# EAGLE design ultra96_mipi (EAGLE 9.7.0)
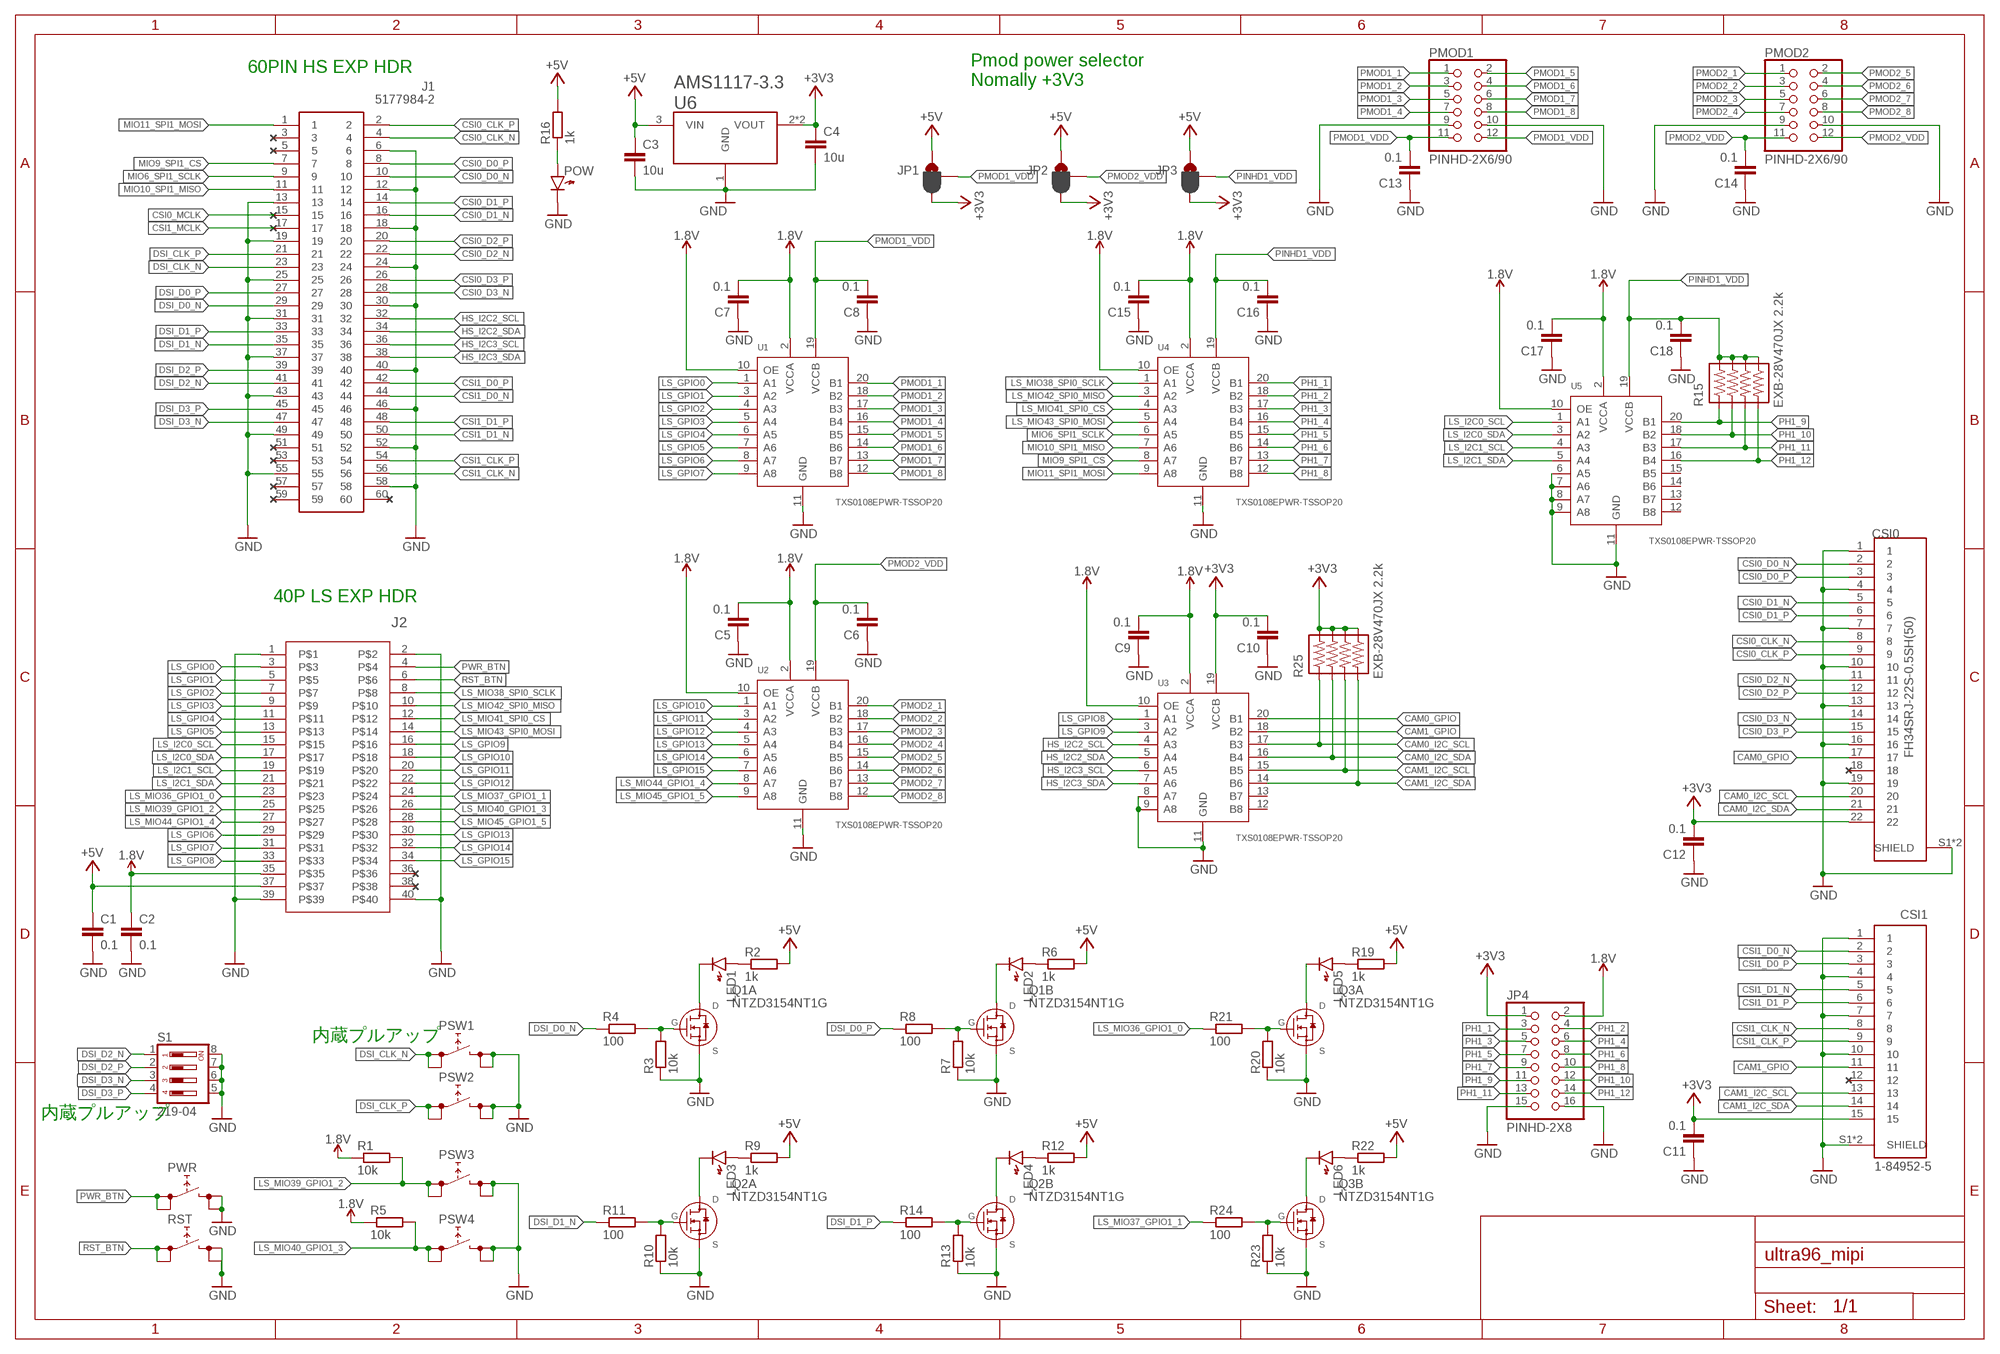
[diagram p0: schematic, sheet 1]

## Parts
C1  0.1  C-EUC0603  [C0603]
C2  0.1  C-EUC0603  [C0603]
C3  10u  C-EUC0603  [C0603]
C4  10u  C-EUC0603  [C0603]
C5  0.1  C-EUC0603  [C0603]
C6  0.1  C-EUC0603  [C0603]
C7  0.1  C-EUC0603  [C0603]
C8  0.1  C-EUC0603  [C0603]
C9  0.1  C-EUC0603  [C0603]
C10  0.1  C-EUC0603  [C0603]
C11  0.1  C-EUC0603  [C0603]
C12  0.1  C-EUC0603  [C0603]
C13  0.1  C-EUC0603  [C0603]
C14  0.1  C-EUC0603  [C0603]
C15  0.1  C-EUC0603  [C0603]
C16  0.1  C-EUC0603  [C0603]
C17  0.1  C-EUC0603  [C0603]
C18  0.1  C-EUC0603  [C0603]
CSI0  FH34SRJ-22S-0.5SH(50)  [HRS_FH34SRJ-22S-0.5SH(50)]
CSI1  1-84952-5  [TE_1-84952-5]
J1  5177984-2  [51779842]
J2  57202-G52-20LFCONN40_52-20LF_AMP  [CONN40_52-20LF_AMP]
JP1  JUMPER-SMT_3_1-NC_PASTE_SILK  [SMT-JUMPER_3_1-NC_PASTE_SILK]
JP2  JUMPER-SMT_3_1-NC_PASTE_SILK  [SMT-JUMPER_3_1-NC_PASTE_SILK]
JP3  JUMPER-SMT_3_1-NC_PASTE_SILK  [SMT-JUMPER_3_1-NC_PASTE_SILK]
JP4  PINHD-2X8  [2X08]
LED1  LED1608  [LED1608]
LED2  LED1608  [LED1608]
LED3  LED1608  [LED1608]
LED4  LED1608  [LED1608]
LED5  LED1608  [LED1608]
LED6  LED1608  [LED1608]
PMOD1  PINHD-2X6/90  [2X06/90]
PMOD2  PINHD-2X6/90  [2X06/90]
POW  LED1608  [LED1608]
PSW1  SKRPACE010  [SKRPACE010]
PSW2  SKRPACE010  [SKRPACE010]
PSW3  SKRPACE010  [SKRPACE010]
PSW4  SKRPACE010  [SKRPACE010]
PWR  SKRPACE010  [SKRPACE010]
Q1  NTZD3154NT1G  [SOTFL50P160X60-6N]
Q2  NTZD3154NT1G  [SOTFL50P160X60-6N]
Q3  NTZD3154NT1G  [SOTFL50P160X60-6N]
R1  10k  R-EU_R0603  [R0603]
R2  1k  R-EU_R0603  [R0603]
R3  10k  R-EU_R0603  [R0603]
R4  100  R-EU_R0603  [R0603]
R5  10k  R-EU_R0603  [R0603]
R6  1k  R-EU_R0603  [R0603]
R7  10k  R-EU_R0603  [R0603]
R8  100  R-EU_R0603  [R0603]
R9  1k  R-EU_R0603  [R0603]
R10  10k  R-EU_R0603  [R0603]
R11  100  R-EU_R0603  [R0603]
R12  1k  R-EU_R0603  [R0603]
R13  10k  R-EU_R0603  [R0603]
R14  100  R-EU_R0603  [R0603]
R15  EXB-28V470JX 2.2k  EXB-28V470JX  [EXB-28V470JX]
R16  1k  R-EU_R0603  [R0603]
R19  1k  R-EU_R0603  [R0603]
R20  10k  R-EU_R0603  [R0603]
R21  100  R-EU_R0603  [R0603]
R22  1k  R-EU_R0603  [R0603]
R23  10k  R-EU_R0603  [R0603]
R24  100  R-EU_R0603  [R0603]
R25  EXB-28V470JX 2.2k  EXB-28V470JX  [EXB-28V470JX]
RST  SKRPACE010  [SKRPACE010]
S1  219-04  [CTS-219-04]
U1  TXS0108EPWR-TSSOP20  LOGIC-TXS0108EPWR(TSSOP20)  [TSSOP20-0.65-6.5X4.4MM]
U2  TXS0108EPWR-TSSOP20  LOGIC-TXS0108EPWR(TSSOP20)  [TSSOP20-0.65-6.5X4.4MM]
U3  TXS0108EPWR-TSSOP20  LOGIC-TXS0108EPWR(TSSOP20)  [TSSOP20-0.65-6.5X4.4MM]
U4  TXS0108EPWR-TSSOP20  LOGIC-TXS0108EPWR(TSSOP20)  [TSSOP20-0.65-6.5X4.4MM]
U5  TXS0108EPWR-TSSOP20  LOGIC-TXS0108EPWR(TSSOP20)  [TSSOP20-0.65-6.5X4.4MM]
U6  AMS1117-3.3  [SOT229P700X180-4N]

## Nets
1.8V: C2.1 C5.2 C7.2 C9.2 C15.2 C17.2 J2.35 JP4.2 R1.1 R5.1 U1.2(VCCA) U1.10(OE) U2.2(VCCA) U2.10(OE) U3.2(VCCA) U3.10(OE) U4.2(VCCA) U4.10(OE) U5.2(VCCA) U5.10(OE)
+3V3: C4.1 C10.2 C11.2 C12.2 CSI0.22 CSI1.15 JP1.3 JP2.3 JP3.3 JP4.1 R25.5 R25.6 R25.7 R25.8 U3.19(VCCB) U6.2(VOUT) U6.4(VOUT)
+5V: C1.1 C3.1 J2.37 JP1.1 JP2.1 JP3.1 R2.2 R6.2 R9.2 R12.2 R16.2 R19.2 R22.2 U6.3(VIN)
CAM0_GPIO: CSI0.17 U3.20(B1)
CAM0_I2C_SCL: CSI0.20 R25.1 U3.17(B3)
CAM0_I2C_SDA: CSI0.21 R25.2 U3.16(B4)
CAM1_GPIO: CSI1.11 U3.18(B2)
CAM1_I2C_SCL: CSI1.13 R25.3 U3.15(B5)
CAM1_I2C_SDA: CSI1.14 R25.4 U3.14(B6)
CSI0_CLK_N: CSI0.8 J1.4
CSI0_CLK_P: CSI0.9 J1.2
CSI0_D0_N: CSI0.2 J1.10
CSI0_D0_P: CSI0.3 J1.8
CSI0_D1_N: CSI0.5 J1.16
CSI0_D1_P: CSI0.6 J1.14
CSI0_D2_N: CSI0.11 J1.22
CSI0_D2_P: CSI0.12 J1.20
CSI0_D3_N: CSI0.14 J1.28
CSI0_D3_P: CSI0.15 J1.26
CSI0_MCLK: J1.15
CSI1_CLK_N: CSI1.8 J1.56
CSI1_CLK_P: CSI1.9 J1.54
CSI1_D0_N: CSI1.2 J1.44
CSI1_D0_P: CSI1.3 J1.42
CSI1_D1_N: CSI1.5 J1.50
CSI1_D1_P: CSI1.6 J1.48
CSI1_MCLK: J1.17
DSI_CLK_N: J1.23 PSW1.1 PSW1.2
DSI_CLK_P: J1.21 PSW2.1 PSW2.2
DSI_D0_N: J1.29 R4.1
DSI_D0_P: J1.27 R8.1
DSI_D1_N: J1.35 R11.1
DSI_D1_P: J1.33 R14.1
DSI_D2_N: J1.41 S1.1
DSI_D2_P: J1.39 S1.2
DSI_D3_N: J1.47 S1.3
DSI_D3_P: J1.45 S1.4
GND: C1.2 C2.2 C3.2 C4.2 C5.1 C6.1 C7.1 C8.1 C9.1 C10.1 C11.1 C12.1 C13.1 C14.1 C15.1 C16.1 C17.1 C18.1 CSI0.1 CSI0.4 CSI0.7 CSI0.10 CSI0.13 CSI0.16 CSI0.19 CSI0.S1(SHIELD) CSI0.S2(SHIELD) CSI1.1 CSI1.4 CSI1.7 CSI1.10 CSI1.S1(SHIELD) CSI1.S2(SHIELD) J1.6 J1.12 J1.13 J1.18 J1.19 J1.24 J1.25 J1.30 J1.31 J1.37 J1.40 J1.43 J1.46 J1.49 J1.52 J1.55 J1.58 J2.1 J2.2 J2.39 J2.40 JP4.15 JP4.16 PMOD1.9 PMOD1.10 PMOD2.9 PMOD2.10 POW.K PSW1.3 PSW1.4 PSW2.3 PSW2.4 PSW3.3 PSW3.4 PSW4.3 PSW4.4 PWR.3 PWR.4 Q1.1(A:S1) Q1.4(B:S1) Q2.1(A:S1) Q2.4(B:S1) Q3.1(A:S1) Q3.4(B:S1) R3.1 R7.1 R10.1 R13.1 R20.1 R23.1 RST.3 RST.4 S1.5 S1.6 S1.7 S1.8 U1.11(GND) U2.11(GND) U3.8(A7) U3.9(A8) U3.11(GND) U4.11(GND) U5.6(A5) U5.7(A6) U5.8(A7) U5.9(A8) U5.11(GND) U6.1(GND)
HS_I2C2_SCL: J1.32 U3.4(A3)
HS_I2C2_SDA: J1.34 U3.5(A4)
HS_I2C3_SCL: J1.36 U3.6(A5)
HS_I2C3_SDA: J1.38 U3.7(A6)
LS_GPIO0: J2.3 U1.1(A1)
LS_GPIO1: J2.5 U1.3(A2)
LS_GPIO2: J2.7 U1.4(A3)
LS_GPIO3: J2.9 U1.5(A4)
LS_GPIO4: J2.11 U1.6(A5)
LS_GPIO5: J2.13 U1.7(A6)
LS_GPIO6: J2.29 U1.8(A7)
LS_GPIO7: J2.31 U1.9(A8)
LS_GPIO8: J2.33 U3.1(A1)
LS_GPIO9: J2.16 U3.3(A2)
LS_GPIO10: J2.18 U2.1(A1)
LS_GPIO11: J2.20 U2.3(A2)
LS_GPIO12: J2.22 U2.4(A3)
LS_GPIO13: J2.30 U2.5(A4)
LS_GPIO14: J2.32 U2.6(A5)
LS_GPIO15: J2.34 U2.7(A6)
LS_I2C0_SCL: J2.15 U5.1(A1)
LS_I2C0_SDA: J2.17 U5.3(A2)
LS_I2C1_SCL: J2.19 U5.4(A3)
LS_I2C1_SDA: J2.21 U5.5(A4)
LS_MIO36_GPIO1_0: J2.23 R21.1
LS_MIO37_GPIO1_1: J2.24 R24.1
LS_MIO38_SPI0_SCLK: J2.8 U4.1(A1)
LS_MIO39_GPIO1_2: J2.25 PSW3.1 PSW3.2 R1.2
LS_MIO40_GPIO1_3: J2.26 PSW4.1 PSW4.2 R5.2
LS_MIO41_SPI0_CS: J2.12 U4.4(A3)
LS_MIO42_SPI0_MISO: J2.10 U4.3(A2)
LS_MIO43_SPI0_MOSI: J2.14 U4.5(A4)
LS_MIO44_GPIO1_4: J2.27 U2.8(A7)
LS_MIO45_GPIO1_5: J2.28 U2.9(A8)
MIO6_SPI1_SCLK: J1.9 U4.6(A5)
MIO9_SPI1_CS: J1.7 U4.8(A7)
MIO10_SPI1_MISO: J1.11 U4.7(A6)
MIO11_SPI1_MOSI: J1.1 U4.9(A8)
N$1: LED1.A R2.1
N$2: LED1.K Q1.6(A:D1)
N$3: Q1.2(A:G1) R3.2 R4.2
N$4: LED3.A R9.1
N$5: LED2.A R6.1
N$6: LED3.K Q2.6(A:D1)
N$7: POW.A R16.1
N$8: LED2.K Q1.3(B:D1)
N$9: LED4.K Q2.3(B:D1)
N$21: Q1.5(B:G1) R7.2 R8.2
N$23: Q2.2(A:G1) R10.2 R11.2
N$24: LED5.A R19.1
N$25: LED4.A R12.1
N$27: LED5.K Q3.6(A:D1)
N$28: Q3.2(A:G1) R20.2 R21.2
N$29: LED6.A R22.1
N$30: LED6.K Q3.3(B:D1)
N$31: Q3.5(B:G1) R23.2 R24.2
N$33: Q2.5(B:G1) R13.2 R14.2
PH1_1: JP4.3 U4.20(B1)
PH1_2: JP4.4 U4.18(B2)
PH1_3: JP4.5 U4.17(B3)
PH1_4: JP4.6 U4.16(B4)
PH1_5: JP4.7 U4.15(B5)
PH1_6: JP4.8 U4.14(B6)
PH1_7: JP4.9 U4.13(B7)
PH1_8: JP4.10 U4.12(B8)
PH1_9: JP4.11 R15.1 U5.20(B1)
PH1_10: JP4.12 R15.2 U5.18(B2)
PH1_11: JP4.13 R15.3 U5.17(B3)
PH1_12: JP4.14 R15.4 U5.16(B4)
PINHD1_VDD: C16.2 C18.2 JP3.2 R15.5 R15.6 R15.7 R15.8 U4.19(VCCB) U5.19(VCCB)
PMOD1_1: PMOD1.1 U1.20(B1)
PMOD1_2: PMOD1.3 U1.18(B2)
PMOD1_3: PMOD1.5 U1.17(B3)
PMOD1_4: PMOD1.7 U1.16(B4)
PMOD1_5: PMOD1.2 U1.15(B5)
PMOD1_6: PMOD1.4 U1.14(B6)
PMOD1_7: PMOD1.6 U1.13(B7)
PMOD1_8: PMOD1.8 U1.12(B8)
PMOD1_VDD: C8.2 C13.2 JP1.2 PMOD1.11 PMOD1.12 U1.19(VCCB)
PMOD2_1: PMOD2.1 U2.20(B1)
PMOD2_2: PMOD2.3 U2.18(B2)
PMOD2_3: PMOD2.5 U2.17(B3)
PMOD2_4: PMOD2.7 U2.16(B4)
PMOD2_5: PMOD2.2 U2.15(B5)
PMOD2_6: PMOD2.4 U2.14(B6)
PMOD2_7: PMOD2.6 U2.13(B7)
PMOD2_8: PMOD2.8 U2.12(B8)
PMOD2_VDD: C6.2 C14.2 JP2.2 PMOD2.11 PMOD2.12 U2.19(VCCB)
PWR_BTN: J2.4 PWR.1 PWR.2
RST_BTN: J2.6 RST.1 RST.2
Unconnected: CSI0.18 CSI1.12 J1.3 J1.5 J1.51 J1.53 J1.57 J1.59 J1.60 J2.36 J2.38 U3.12(B8) U3.13(B7) U5.12(B8) U5.13(B7) U5.14(B6) U5.15(B5)

## Notes on the sheet
- 60PIN HS EXP HDR
- Pmod power selector
  Nomally +3V3
- 40P LS EXP HDR
- 内蔵プルアップ
- 内蔵プルアップ

## Library data of the parts
C1-C18 = rcl:C-EU: CAPACITOR, European symbol; SPICEPREFIX: C
CSI0 = FH34SRJ-22S-0.5SH:FH34SRJ-22S-0.5SH(50): Check availability <https://pricing.snapeda.com/parts/FH34SRJ-22S-0.5SH%2850%29/Hirose%20Electric%20Co%20Ltd/view-part?ref=eda>; AVAILABILITY: In Stock; DESCRIPTION: 22 Position FFC, FPC Connector Contacts, Top and Bottom 0.020 (0.50mm) Surface Mount, Right Angle; MF: Hirose Electric Co Ltd; MP: FH34SRJ-22S-0.5SH(50); PACKAGE: None; PRICE: None; PURCHASE-URL: https://pricing.snapeda.com/search/part/FH34SRJ-22S-0.5SH(50)/?ref=eda
CSI1 = 1-84952-5:1-84952-5; COMMENT: 1-84952-5; EU_ROHS_COMPLIANCE: Compliant
J1 = 5177984-2:5177984-2: 60 way 0.8mm pitch SMT header,5mm H Source: Datasheet <https://datasheet.datasheetarchive.com/originals/distributors/Datasheets_SAMA/798bc7bd498d8f2cc2b47bb00bbdf8ae.pdf>; ARROW_PART_NUMBER: 5177984-2; ARROW_PRICE-STOCK: https://www.arrow.com/en/products/5177984-2/te-connectivity?region=europe; DESCRIPTION: 60 way 0.8mm pitch SMT header,5mm H; HEIGHT: 4.9mm; MANUFACTURER_NAME: TE Connectivity; MANUFACTURER_PART_NUMBER: 5177984-2; MOUSER_PART_NUMBER: 571-5177984-2; MOUSER_PRICE-STOCK: https://www.mouser.co.uk/ProductDetail/TE-Connectivity/5177984-2?qs=iZLSzymdj4T%252BY6P87SFSbw%3D%3D
J2 = 57202-G52-20LF:57202-G52-20LF; COPYRIGHT: Copyright (C) 2023 Ultra Librarian. All rights reserved.; DIGI-KEY_PART_NUMBER_1: 609-2632-ND; MANUFACTURER_PART_NUMBER: 57202-G52-20LF; MFR_NAME: Amphenol ICC
JP1-JP3 = SparkFun-Jumpers:JUMPER-SMT_3_1-NC_PASTE: Normally closed solder jumper (1 of 2 connections) This jumper has an aperture in the stencil to allow solder paste to bridge one of the two connections. One connection is normally closed (NC), while the other is normally open (NO). Wick off the solder to open the connection. Reapply solder to reclose the connection. Apply solder to the other side instead to change the current path.
JP4 = Connector:PINHD-2X8: PIN HEADER; CATEGORY: CONNECTOR; SUB-CATEGORY: PIN-HEADER
LED1-LED6 POW = generic:LED: Generic LEDs
PMOD1 PMOD2 = Connector:PINHD-2X6: PIN HEADER; CATEGORY: CONNECTOR; SUB-CATEGORY: PIN-HEADER
PSW1-PSW4 PWR RST = Switches:SKRPACE010
Q1-Q3 = NTZD3154NT1G:NTZD3154NT1G: Dual N-channel MOSFET Transistor, 0.57 A, 20 V, 6-pin SOT-563 Source: Datasheet <http://www.onsemi.com/pub/Collateral/NTZD3154N-D.PDF>; ARROW_PART_NUMBER: NTZD3154NT1G; ARROW_PRICE-STOCK: https://www.arrow.com/en/products/ntzd3154nt1g/on-semiconductor?region=nac; DESCRIPTION: Dual N-channel MOSFET Transistor, 0.57 A, 20 V, 6-pin SOT-563; HEIGHT: 0.6mm; MANUFACTURER_NAME: onsemi; MANUFACTURER_PART_NUMBER: NTZD3154NT1G; MOUSER_PART_NUMBER: 863-NTZD3154NT1G; MOUSER_PRICE-STOCK: https://www.mouser.co.uk/ProductDetail/onsemi/NTZD3154NT1G?qs=ZXBb0xZ9WeCaNvsHF5F8%252BA%3D%3D
R1-R14 R16 R19-R24 = rcl:R-EU_: RESISTOR, European symbol; SPICEPREFIX: R
R15 R25 = Resistor Array:EXB-28V470JX: RES ARRAY 4 RES 47 OHM 0804 Manufacturer's datasheet <https://industrial.panasonic.com/cdbs/www-data/pdf/AOC0000/AOC0000C14.pdf>; CREATED_BY: PCBLayout.com; DIGIKEY_PARTNO: Y7470TR-ND; MANUFACTURER: Panasonic Electronic Components; MPN: EXB-28V470JX; PACKAGE: 0804
S1 = switch-dil:219-04*: Surface Mount DIP Switch Series 219 SMT CTS Electronic Components Sourc: www.ctscorp.com; OC_FARNELL: unknown; OC_NEWARK: unknown
U1-U5 = OPL_IC:LOGIC-TXS0108EPWR(TSSOP20): 310050026; MPN: TXS0108EPWR
U6 = AMS1117-3.3:AMS1117-3.3: Check availability <https://pricing.snapeda.com/parts/AMS1117-3.3/Advanced%20Monolithic%20Systems/view-part?ref=eda>; AVAILABILITY: In Stock; DESCRIPTION: Sot223/Pkg 1-Amp 3.3-Volt Low Drop Out Voltage Regulatator; MF: Advanced Monolithic Systems; MP: AMS1117-3.3; PACKAGE: SOT-223 Seeed Technology; PRICE: None

## Board
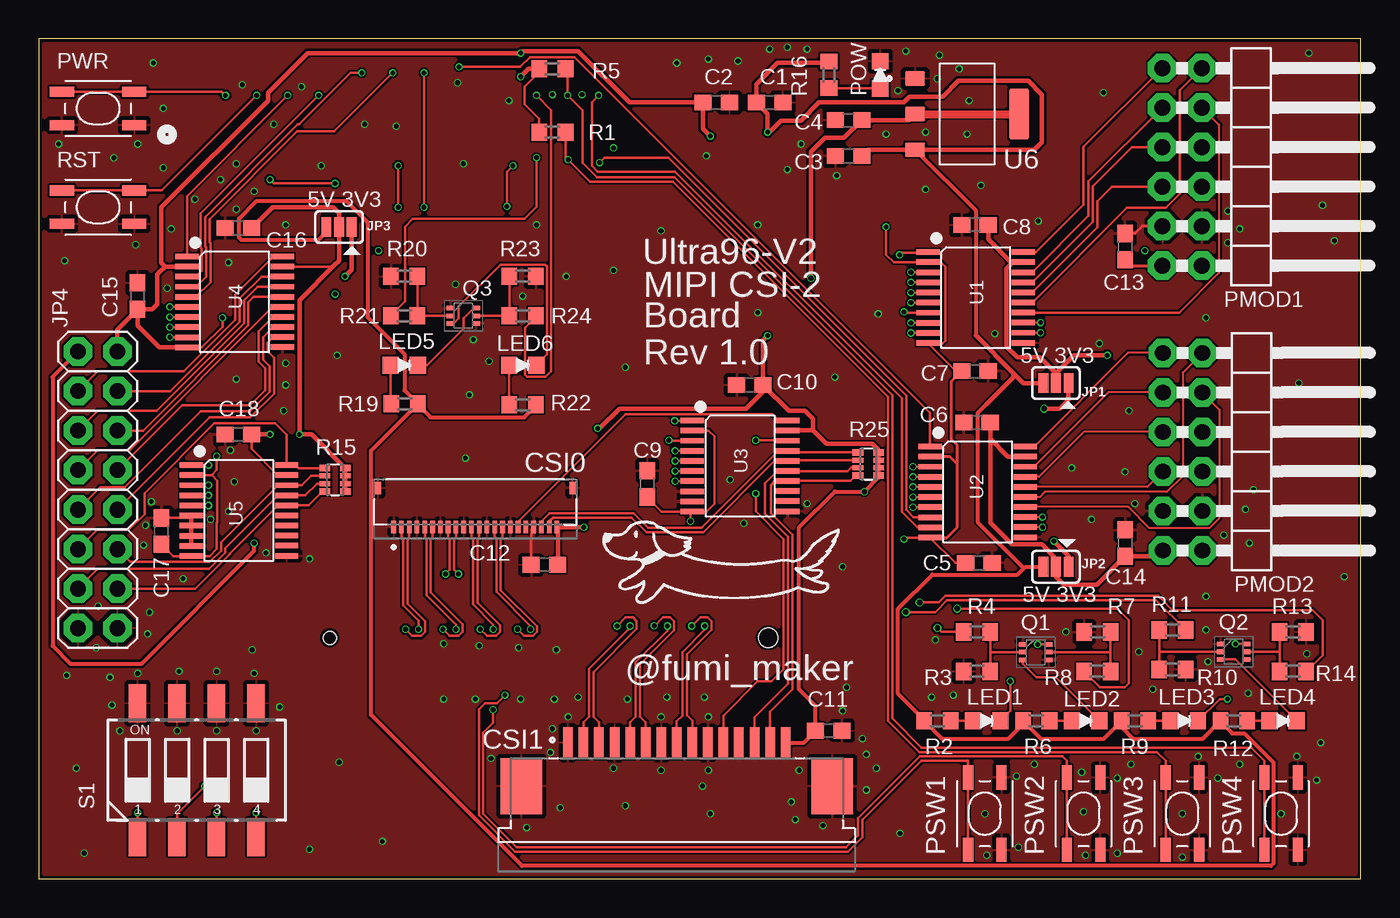
[diagram p1: board, top side]
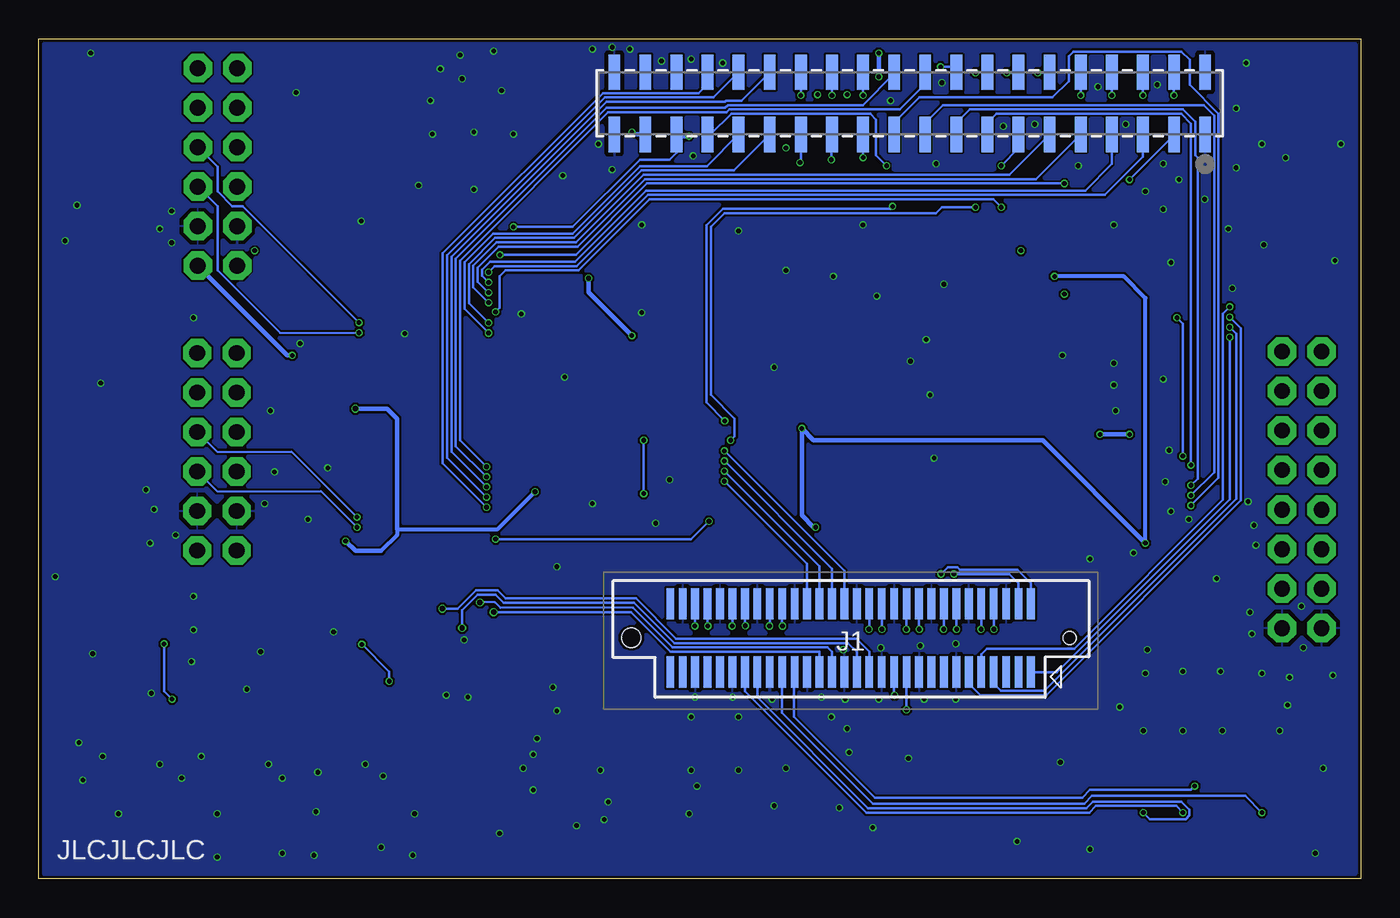
[diagram p2: board, bottom side, seen from below]

Size 85 x 54 mm. Coordinates in mm from the lower left corner, seen from the top.
Outline: 0,54 0,0 85,0 85,54 0,54
Copper layers (1*16): Top / Bottom
Stack-up Default Layer Stack: Top User Defined 0.035mm / Dielectric-1 User Defined 1.6mm / Bottom User Defined 0.035mm
Design rules "jlcpcb-2layers": minimum track width 5mil, minimum drill 0.3mm, track to track 5mil, track to pad 5mil, pad to pad 5mil, via to via 5mil, smd to smd 5mil, copper to edge 0.2mm, drill to drill 6mil, minimum pad ring 10mil, minimum via ring 3mil, stop-mask expansion 4mil, vias tented up to drill 0mil, thermal gap 10mil

### Footprints (pad centres in the part's own frame; a part is rotated, then mirrored left to right if it is on the bottom)
C0603 = smd 1.1 x 1: 1 -0.85,0; 2 0.85,0
HRS_FH34SRJ-22S-0.5SH(50) = smd 0.3 x 0.8: 1 5.25,1.25; 2 4.75,1.25; 3 4.25,1.25; 4 3.75,1.25; 5 3.25,1.25; 6 2.75,1.25; 7 2.25,1.25; 8 1.75,1.25; 9 1.25,1.25; 10 0.75,1.25; 11 0.25,1.25; 12 -0.25,1.25; 13 -0.75,1.25; 14 -1.25,1.25; 15 -1.75,1.25; 16 -2.25,1.25; 17 -2.75,1.25; 18 -3.25,1.25; 19 -3.75,1.25; 20 -4.25,1.25; 21 -4.75,1.25; 22 -5.25,1.25 | smd 0.4 x 0.8: S1 6.25,-1.25; S2 -6.25,-1.25
TE_1-84952-5 = smd 0.61 x 2: 1 -7,0; 2 -6,0; 3 -5,0; 4 -4,0; 5 -3,0; 6 -2,0; 7 -1,0; 8 0,0; 9 1,0; 10 2,0; 11 3,0; 12 4,0; 13 5,0; 14 6,0; 15 7,0 | smd 2.68 x 3.6: S1 -9.99,-2.8; S2 9.99,-2.8
51779842 = smd 0.5 x 2: 1 -11.6,2.2; 2 -11.6,-2.2; 3 -10.8,2.2; 4 -10.8,-2.2; 5 -10,2.2; 6 -10,-2.2; 7 -9.2,2.2; 8 -9.2,-2.2; 9 -8.4,2.2; 10 -8.4,-2.2; 11 -7.6,2.2; 12 -7.6,-2.2; 13 -6.8,2.2; 14 -6.8,-2.2; 15 -6,2.2; 16 -6,-2.2; 17 -5.2,2.2; 18 -5.2,-2.2; 19 -4.4,2.2; 20 -4.4,-2.2; 21 -3.6,2.2; 22 -3.6,-2.2; 23 -2.8,2.2; 24 -2.8,-2.2; 25 -2,2.2; 26 -2,-2.2; 27 -1.2,2.2; 28 -1.2,-2.2; 29 -0.4,2.2; 30 -0.4,-2.2; 31 0.4,2.2; 32 0.4,-2.2; 33 1.2,2.2; 34 1.2,-2.2; 35 2,2.2; 36 2,-2.2; 37 2.8,2.2; 38 2.8,-2.2; 39 3.6,2.2; 40 3.6,-2.2; 41 4.4,2.2; 42 4.4,-2.2; 43 5.2,2.2; 44 5.2,-2.2; 45 6,2.2; 46 6,-2.2; 47 6.8,2.2; 48 6.8,-2.2; 49 7.6,2.2; 50 7.6,-2.2; 51 8.4,2.2; 52 8.4,-2.2; 53 9.2,2.2; 54 9.2,-2.2; 55 10,2.2; 56 10,-2.2; 57 10.8,2.2; 58 10.8,-2.2; 59 11.6,2.2; 60 11.6,-2.2 | hole 0.83: -14.1,0 | hole 1.23: 14.1,0
CONN40_52-20LF_AMP = smd 0.762 x 2.261: 1 0,0; 2 0,-4; 3 2,0; 4 2,-4; 5 4,0; 6 4,-4; 7 6,0; 8 6,-4; 9 8,0; 10 8,-4; 11 10,0; 12 10,-4; 13 12,0; 14 12,-4; 15 14,0; 16 14,-4; 17 16,0; 18 16,-4; 19 18,0; 20 18,-4; 21 20,0; 22 20,-4; 23 22,0; 24 22,-4; 25 24,0; 26 24,-4; 27 26,0; 28 26,-4; 29 28,0; 30 28,-4; 31 30,0; 32 30,-4; 33 32,0; 34 32,-4; 35 34,0; 36 34,-4; 37 36,0; 38 36,-4; 39 38,0; 40 38,-4
SMT-JUMPER_3_1-NC_PASTE_SILK = smd 0.635 x 1.27: 1 -0.813,0; 2 0,0; 3 0.813,0
2X08 = drill 1.016 octagon: 1 -8.89,-1.27; 2 -8.89,1.27; 3 -6.35,-1.27; 4 -6.35,1.27; 5 -3.81,-1.27; 6 -3.81,1.27; 7 -1.27,-1.27; 8 -1.27,1.27; 9 1.27,-1.27; 10 1.27,1.27; 11 3.81,-1.27; 12 3.81,1.27; 13 6.35,-1.27; 14 6.35,1.27; 15 8.89,-1.27; 16 8.89,1.27
LED1608 = smd 1.05 x 1.08: A -0.875,0; K 0.875,0
2X06/90 = drill 1.016 octagon: 1 -6.35,-6.35; 2 -6.35,-3.81; 3 -3.81,-6.35; 4 -3.81,-3.81; 5 -1.27,-6.35; 6 -1.27,-3.81; 7 1.27,-6.35; 8 1.27,-3.81; 9 3.81,-6.35; 10 3.81,-3.81; 11 6.35,-6.35; 12 6.35,-3.81
SKRPACE010 = smd 1.55 x 0.65: 1 -2.325,1.075; 2 2.325,1.075; 3 -2.325,-1.075; 4 2.325,-1.075
SOTFL50P160X60-6N = smd 0.475 x 0.3: 1 -0.838,0.5; 2 -0.838,0; 3 -0.838,-0.5; 4 0.838,-0.5; 5 0.838,0; 6 0.838,0.5
R0603 = smd 1 x 1.1: 1 -0.85,0; 2 0.85,0
EXB-28V470JX = smd 0.692 x 0.422: 1 -0.66,0.75; 4 -0.66,-0.75; 5 0.66,-0.75; 8 0.66,0.75 | smd 0.692 x 0.322: 2 -0.66,0.25; 3 -0.66,-0.25; 6 0.66,-0.25; 7 0.66,0.25
CTS-219-04 = smd 1.13 x 2.44: 1 -3.81,-4.3; 2 -1.27,-4.3; 3 1.27,-4.3; 4 3.81,-4.3; 5 3.81,4.3; 6 1.27,4.3; 7 -1.27,4.3; 8 -3.81,4.3
TSSOP20-0.65-6.5X4.4MM = smd 0.35 x 1.5: 1 -2.925,-3.065; 2 -2.275,-3.065; 3 -1.625,-3.065; 4 -0.975,-3.065; 5 -0.325,-3.065; 6 0.325,-3.065; 7 0.975,-3.065; 8 1.625,-3.065; 9 2.275,-3.065; 10 2.925,-3.065; 11 2.91,3.065; 12 2.26,3.065; 13 1.61,3.065; 14 0.96,3.065; 15 0.325,3.065; 16 -0.325,3.065; 17 -0.975,3.065; 18 -1.625,3.065; 19 -2.275,3.065; 20 -2.925,3.065
SOT229P700X180-4N = smd 1.31 x 0.93: 1 -3.345,2.29; 2 -3.345,0; 3 -3.345,-2.29 | smd 1.31 x 3.24: 4 3.345,0

### Placement (x,y rotation side)
C1  46.99,49.91 0 top
C2  43.56,49.91 0 top
C3  52.07,46.48 180 top
C4  52.07,48.78 180 top
C5  60.45,20.32 180 top
C6  60.33,29.34 0 top
C7  60.2,32.64 180 top
C8  60.2,42.05 0 top
C9  39.12,25.4 270 top
C10  45.72,31.75 0 top
C11  50.8,9.53 180 top
C12  32.51,20.19 0 top
C13  69.85,40.64 270 top
C14  69.85,21.59 270 top
C15  6.35,37.47 270 top
C16  12.83,41.84 0 top
C17  7.87,22.35 270 top
C18  12.83,28.57 0 top
CSI0  28.07,23.88 180 top
CSI1  41.02,8.76 0 top
J1  32.8,15.5 180 bottom
J2  10,47.85 180 bottom
JP1  65.41,31.88 0 top
JP2  65.41,20.07 0 top
JP3  19.3,41.91 0 top
JP4  3.78,25.01 270 top
LED1  60.96,10.16 0 top
LED2  67.31,10.16 0 top
LED3  73.66,10.16 0 top
LED4  80.01,10.16 0 top
LED5  23.5,33.02 0 top
LED6  31.11,33.02 0 top
PMOD1  78.6,45.77 270 top
PMOD2  78.63,27.46 270 top
POW  54.1,51.69 90 top
PSW1  60.83,4.19 90 top
PSW2  67.18,4.19 90 top
PSW3  73.53,4.19 90 top
PSW4  79.88,4.19 90 top
PWR  3.81,49.53 0 top
Q1  64.11,14.58 0 top
Q2  76.83,14.61 0 top
Q3  27.3,36.2 0 top
R1  33.02,47.99 0 top
R2  57.78,10.16 180 top
R3  60.33,13.34 0 top
R4  60.33,15.88 0 top
R5  33.02,52.07 0 top
R6  64.14,10.16 180 top
R7  68.07,15.88 0 top
R8  68.06,13.34 0 top
R9  70.48,10.16 180 top
R10  72.9,13.46 180 top
R11  72.9,16 180 top
R12  76.83,10.16 180 top
R13  80.64,15.88 180 top
R14  80.64,13.34 180 top
R15  19.05,25.65 0 top
R16  50.8,51.69 90 top
R19  23.53,30.53 0 top
R20  23.5,38.73 0 top
R21  23.5,36.2 0 top
R22  31.11,30.48 0 top
R23  31.11,38.73 180 top
R24  31.11,36.2 180 top
R25  53.34,26.67 0 top
RST  3.81,43.18 0 top
S1  10.16,6.99 0 top
U1  60.25,37.37 270 top
U2  60.38,24.87 270 top
U3  45.09,26.54 270 top
U4  12.59,37.09 270 top
U5  12.87,23.68 270 top
U6  59.69,49.17 0 top

### Tracks (layer width: path | path; a pad name or v marks a point on that pad's centre or on a via)
1.8V  (via drill 0.3)
  Top 0.152: C5.2 58.94,20.32 U2.10 55.73,21.95 v55.63,21.84 | C7.2 58.99,32.64 U1.10 58.13,34.44 58.29,34.61 58.29,39.35 58.02,39.62 57.2,39.62 U1.2 54.97,39.64 54.48,40.13 v54.48,41.91 | C17.2 8.62,20.75 U5.10 10.97,20.75 11.43,21.21 11.43,22.89 11.48,22.94 11.48,25.61 11.13,25.95 | 41.91,23.61 U3.10 42.92,23.61 43.43,24.13 43.43,28.45 43.07,28.82 U3.2 | 41.91,23.61 40.05,23.61 C9.2 | 11.13,25.95 U5.2 | R1.1 32.17,48.86 31.24,49.78 31.24,50.93 32.17,51.85 R5.1 | v41.91,22.99 41.91,23.61 | 11.13,25.95 11.13,25.99 11.43,26.29 v11.43,27.18 | v11.81,36.07 11.81,35.51 10.47,34.17 U4.10
  Top 0.2: U2.10 58.39,21.95 59.05,22.61 59.05,26.67 | 59.05,26.67 58.58,27.14 U2.2 | 59.05,26.67 59.05,27.88 58.7,28.23 58.7,31.99 C7.2
  Top 0.305: v43.18,47.75 42.71,48.22 C2.1 37.97,49.91 34.67,53.21 31.11,53.21 v30.99,53.09 17.27,53.09 14.73,50.55 14.73,50.04 7.87,43.18 7.87,39.62 8.13,39.37 | v30.99,51.56 31.5,52.07 R5.1 | 8.13,39.37 U4.2 | 8.13,39.37 7.75,38.99 7.62,38.86 7.62,36.96 7.28,36.62 C15.2 | JP4.2 5.05,35.31 C15.2 | U4.10 7.74,34.17 6.35,35.56 C15.2
  Bottom 0.152: v54.48,41.91 50.67,41.91 46.35,46.23 44.45,46.23 44,46.68 J2.35 | v55.63,21.84 43.05,21.84 v41.91,22.99 | v11.43,27.18 11.43,35.69 v11.81,36.07
  Bottom 0.305: J2.35 43.9,47.75 v43.18,47.75 | v30.99,53.09 v30.99,51.56
+3V3  (via drill 0.3, 0.35)
  Top 0.152: R25.7 R25.8 | 48.17,28.83 U3.19
  Top 0.254: CSI1.15 49.19,8.76 C11.2 49.95,11.14 48.9,12.19 48.9,22.61 51.18,24.89 v53.09,24.89 54,25.81 R25.5 | JP4.1 0.89,32.28 0.89,14.99 2.03,13.84 6.6,13.84 13.84,21.08 v13.84,21.59
  Top 0.305: R25.5 R25.6 R25.7 54,27.58 53.62,27.96 50.65,27.96 49.78,28.83 | C10.2 48.22,30.1 49.28,30.1 49.78,29.59 49.78,28.83 | 49.78,28.83 48.17,28.83 | C10.2 46.57,34.63 v46.86,34.92 | U6.2 55.96,48.78 C4.1 51.78,47.64 50.55,47.64 49.66,46.74 v49.66,38.61 | C10.2 46.57,31.33 45.47,30.23 37.34,30.23 36.07,28.96 v35.94,28.96 | v35.05,22.61 33.4,22.61 | 33.4,22.61 33.34,22.61 CSI0.22 | 33.4,22.61 33.4,20.23 C12.2 | v19.68,38.73 20.12,39.17 JP3.3 | JP2.3 66.22,20.78 v65.28,21.72 | v64.64,30.23 65.66,30.23 66.22,30.79 JP1.3
  Top 0.508: U6.2 U6.4
  Bottom 0.254: 62.99,21.08 61.98,22.1 61.98,22.48 55.5,22.48 v53.09,24.89 | v13.84,21.59 13.84,37.34 15.24,38.73 v19.68,38.73
  Bottom 0.305: v46.86,34.92 49.66,37.72 v49.66,38.61 | v35.05,22.61 35.18,22.61 35.94,23.37 v35.94,28.96 35.18,28.19 20.45,28.19 v13.84,21.59 | v64.64,30.23 62.61,30.23 61.98,29.59 61.98,22.48 | v65.28,21.72 64.64,21.08 62.99,21.08
+5V  (via drill 0.3)
  Top 0.254: R22.2 31.96,30.43 31.21,29.68 25.18,29.68 24.38,30.48 R19.2 | U6.3 60.24,42.98 60.24,34.94 | 60.91,30.48 60.37,29.94 60.37,22.94 63.34,19.97 | JP2.1 63.44,20.07 63.34,19.97 | JP3.1 18.49,41.59 17.98,41.08 13.02,41.08 12.87,41.23 12.87,42.44 14.02,43.59 19.75,43.59 21.13,42.21 21.13,36.12 23.51,33.74 23.51,31.4 R19.2 | R19.2 21.36,27.52 21.36,10.54 31.07,0.84 79.24,0.84 79.39,0.99 79.39,7.48 77.52,9.36 76.74,9.36 75.98,10.11 R12.2 74.84,9.02 70.36,9.02 69.64,9.74 R9.2 68.49,9.02 64.43,9.02 R6.2 63.28,9.95 62.36,9.02 58.08,9.02 R2.2 56.94,10.21 55.25,11.9 55.25,17.35 57.46,19.57 62.94,19.57 63.34,19.97
  Top 0.305: C3.1 53.3,46.86 56.33,46.86 U6.3 64.02,46.88 64.52,47.37 64.52,50.42 63.63,51.31 59.13,51.31 58.12,50.29 56,50.29 55.62,49.91 50.17,49.91 49.01,48.75 47.73,48.75 46.99,48.01 v46.86,48.01 46.86,49.19 C1.1 46.14,51.09 47.5,52.45 50.71,52.45 R16.2 | 60.24,34.94 62.67,32.51 | 62.67,32.51 63.3,31.88 JP1.1 | 60.91,30.48 62.67,32.24 62.67,32.51
  Bottom 0.305: J2.37 46.71,47.85 v46.86,48.01
CAM0_GPIO
  Top 0.152: U3.20 47.58,29.46 47.17,29.87 37.72,29.87 30.82,22.96 CSI0.17
CAM0_I2C_SCL
  Top 0.152: R25.1 48.25,27.42 U3.17 47.57,27.52 42.61,22.56 39.18,22.56 38.23,23.51 32.84,23.51 32.32,22.98 CSI0.20
CAM0_I2C_SDA
  Top 0.152: R25.2 48.21,26.92 U3.16 47.31,26.86 42.73,22.28 39.06,22.28 38.11,23.23 33.06,23.23 32.82,22.98 CSI0.21
CAM1_GPIO  (via drill 0.3)
  Top 0.152: CSI1.11 44.02,10.49 46.23,12.7 47.12,12.7 47.88,13.46 47.88,21.84 46.1,23.62 v46.1,24.77 | v46.1,28.19 48.13,28.19 U3.18
  Bottom 0.152: v46.1,24.77 v46.1,28.19
CAM1_I2C_SCL
  Top 0.152: R25.3 52.64,26.46 52.25,26.46 52,26.21 U3.15 47.47,26.21 46.69,25.44 46.69,23.48 48.17,22 48.17,12.55 46.02,10.39 CSI1.13
CAM1_I2C_SDA
  Top 0.152: R25.4 52.55,25.92 52.2,25.58 U3.14 48.14,25.56 47.32,25.56 47.08,25.32 47.08,23.5 48.45,22.12 48.45,12.18 47.01,10.74 47.01,8.78 CSI1.14
CSI0_CLK_N  (via drill 0.3)
  Top 0.152: CSI0.8 26.32,21.92 26.43,21.81 26.43,19.88 v26.15,19.6
  Bottom 0.152: J1.4 22,19 22.59,19.6 v26.15,19.6
CSI0_CLK_P  (via drill 0.3)
  Top 0.152: CSI0.9 26.82,21.92 26.71,21.81 26.71,19.88 v26.98,19.6
  Bottom 0.152: J1.2 21.2,19 22.07,19.88 25.79,19.88 25.93,20.03 26.55,20.03 v26.98,19.6
CSI0_D0_N  (via drill 0.3)
  Top 0.152: v24.41,16.05 v24.42,16.05 24.42,16.58 23.42,17.58 23.42,21.8 23.32,21.9 CSI0.2 | v24.41,16.05
  Bottom 0.152: J1.10 24.4,16.07 v24.42,16.05 v24.41,16.05 | v24.41,16.05
CSI0_D0_P  (via drill 0.3)
  Top 0.152: v23.58,16.05 24.01,15.62 24.59,15.62 24.85,15.88 24.85,16.55 23.7,17.7 23.7,21.8 23.82,21.92 CSI0.3
  Bottom 0.152: J1.8 23.6,16.07 v23.58,16.05
CSI0_D1_N  (via drill 0.3)
  Top 0.152: CSI0.5 24.82,22.62 24.82,21.9 24.92,21.8 24.92,18.25 26.82,16.35 v26.82,16.05
  Bottom 0.152: J1.16 26.8,16.07 v26.82,16.05
CSI0_D1_P  (via drill 0.3)
  Top 0.152: v25.98,16.05 26.41,15.62 27,15.62 27.25,15.88 27.25,16.39 25.2,18.43 25.2,21.8 25.32,21.92 CSI0.6
  Bottom 0.152: J1.14 26,16.07 v25.98,16.05
CSI0_D2_N  (via drill 0.3)
  Top 0.152: v29.22,16.05 29.22,16.35 27.93,17.64 27.93,21.8 27.82,21.91 CSI0.11
  Bottom 0.152: J1.22 29.2,16.07 v29.22,16.05
CSI0_D2_P  (via drill 0.3)
  Top 0.152: v28.38,16.05 28.81,15.62 29.39,15.62 29.65,15.88 29.65,16.32 28.21,17.76 28.21,21.8 28.32,21.91 CSI0.12
  Bottom 0.152: J1.20 28.4,16.07 v28.38,16.05
CSI0_D3_N  (via drill 0.3)
  Top 0.152: CSI0.14 29.32,21.97 29.43,21.86 29.43,18.45 31.62,16.26 v31.62,16.05
  Bottom 0.152: J1.28 31.6,16.07 v31.62,16.05
CSI0_D3_P  (via drill 0.3)
  Top 0.152: CSI0.15 29.82,21.98 29.71,21.87 29.71,18.57 32.05,16.23 32.05,15.88 31.8,15.62 31.21,15.62 v30.78,16.05
  Bottom 0.152: J1.26 30.8,16.07 v30.78,16.05
CSI1_CLK_N  (via drill 0.3)
  Top 0.152: CSI1.8 41.02,10.13 41.39,10.49 41.39,14.57 42.82,16 v42.82,16.26
  Bottom 0.152: J1.56 42.8,16.39 42.82,16.38 v42.82,16.26
CSI1_CLK_P  (via drill 0.3)
  Top 0.152: CSI1.9 42.02,10.16 41.66,10.52 41.66,14.44 43.25,16.02 43.25,16.56 42.99,16.81 42.54,16.81 v41.98,16.26
  Bottom 0.152: J1.54 42,16.39 41.98,16.38 v41.98,16.26
CSI1_D0_N  (via drill 0.3)
  Top 0.152: v38.02,16.26 38.02,16.16 35.38,13.52 35.38,12.59 | CSI1.2 35.02,10.07 35.38,10.43 35.38,10.6 35.38,11.3 | 35.38,12.59 | 35.38,11.3 35.38,12.59 | 35.38,11.3
  Bottom 0.152: J1.44 38,16.39 38.02,16.38 v38.02,16.26
CSI1_D0_P  (via drill 0.3)
  Top 0.152: v37.18,16.26 37.74,16.81 38.2,16.81 38.45,16.56 38.45,16.08 35.66,13.29 | CSI1.3 36.02,10.07 35.66,10.43 35.66,10.6 | 35.66,13.29 | 35.66,13.29 35.66,10.6 | 35.66,10.6
  Bottom 0.152: J1.42 37.2,16.39 37.18,16.38 v37.18,16.26
CSI1_D1_N  (via drill 0.3)
  Top 0.152: CSI1.5 38.02,10.07 38.38,10.43 38.38,13.93 40.42,15.96 v40.42,16.26
  Bottom 0.152: J1.50 40.4,16.39 40.42,16.38 v40.42,16.26
CSI1_D1_P  (via drill 0.3)
  Top 0.152: v39.57,16.27 39.58,16.26 40.14,16.81 40.59,16.81 40.85,16.56 40.85,16 38.66,13.81 38.66,10.43 39.02,10.07 CSI1.6
  Bottom 0.152: J1.48 39.6,16.39 39.58,16.38 39.58,16.27 v39.57,16.27
DSI_CLK_N  (via drill 0.3)
  Top 0.152: v29.97,11.81 29.46,11.3 28.7,11.3 28.3,10.9 28.3,4.08 30.62,1.75 52.03,1.75 52.96,2.68 52.96,3.79 56.77,7.6 59.76,7.6 59.76,6.6 PSW1.2 PSW1.1
  Bottom 0.152: J1.23 30,11.84 v29.97,11.81
DSI_CLK_P  (via drill 0.3)
  Top 0.152: v29.21,10.87 29.21,10.03 28.57,9.4 28.57,4.19 30.73,2.03 51.92,2.03 52.68,2.79 52.68,3.9 56.65,7.88 65.83,7.88 66.11,7.6 PSW2.2 PSW2.1
  Bottom 0.152: J1.21 29.2,10.93 29.21,10.92 v29.21,10.87
DSI_D0_N  (via drill 0.35)
  Top 0.152: R4.1 58.04,15.88 v57.78,16.13
  Bottom 0.152: J1.29 32.4,14.61 32.96,15.16 44.13,15.16 46.73,17.75 55.11,17.75 55.62,18.26 56.78,18.26 57.78,17.26 v57.78,16.13
DSI_D0_P  (via drill 0.35)
  Top 0.152: R8.1 68.22,12.32 69.85,12.32 70.1,12.57 70.1,16.64 69.37,17.37 v59.05,17.37
  Bottom 0.152: J1.27 31.6,14.61 32.44,15.44 44.02,15.44 46.61,18.03 54.99,18.03 55.5,18.54 56.9,18.54 58.06,17.37 v59.05,17.37
DSI_D1_N  (via drill 0.35)
  Top 0.152: R11.1 71.84,17.91 58.41,17.91 57.64,17.14 v55.75,17.14
  Bottom 0.152: J1.35 34.8,14.61 44.37,14.61 46.91,17.14 v55.75,17.14 | v55.75,17.14
DSI_D1_P  (via drill 0.35)
  Top 0.152: R14.1 82.55,14.39 82.55,16.64 81.92,17.27 72.9,17.27 72.14,18.03 72.11,18.03 71.96,18.19 58.29,18.19 57.88,17.78 56.64,17.78 v56.63,17.77
  Bottom 0.127: 46.79,17.42 55.31,17.42 55.67,17.78 v56.64,17.78 v56.63,17.77 | 46.79,17.42
  Bottom 0.152: J1.33 34,14.61 34.28,14.88 44.25,14.88 46.79,17.42
DSI_D2_N  (via drill 0.3)
  Top 0.152: v6.35,4.26 S1.1
  Bottom 0.152: v6.35,4.26 7.42,5.33 17.27,5.33 17.78,4.83 31.37,4.83 37.21,10.67 37.21,13.29 J1.41
DSI_D2_P  (via drill 0.3)
  Top 0.152: v10.67,5.97 8.89,4.19 S1.2
  Bottom 0.152: J1.39 36.45,13.25 36.45,10.41 31.24,5.21 17.91,5.21 17.4,5.71 10.92,5.71 v10.67,5.97
DSI_D3_N  (via drill 0.3)
  Top 0.152: v11.43,4.26 S1.3
  Bottom 0.152: J1.47 39.6,12.07 31.79,4.26 17.44,4.26 17.01,4.69 11.86,4.69 v11.43,4.26
DSI_D3_P  (via drill 0.3)
  Top 0.152: v13.97,4.26 S1.4
  Bottom 0.152: J1.45 38.8,11.67 31.68,4.54 17.64,4.54 17.2,4.97 11.53,4.97 11,4.44 11,4.08 11.25,3.83 13.54,3.83 v13.97,4.26
GND  (via drill 0.3)
  Top 0.152: C17.1 9.65,23.2 U5.6 | C12.1 31.66,22.13 31.67,22.14 31.67,22.48 CSI0.19
  Top 0.2: C13.1 70.48,41.49 70.95,41.96 PMOD1.9
  Top 0.305: U5.9 U5.8 U5.7 U5.6
  other vias: 1.65,39.75 7.37,52.45 6.35,47.24 4.83,46.35 1.27,47.24 6.22,40.77 13.72,14.73 19.3,7.49 22.1,2.41 37.72,4.7 43.18,4.19 42.67,5.97 48.39,4.95 51.94,12.32 53.85,7.11 51.69,20.07 78.11,25.02 83.95,19.43 81.03,31.88 75.06,36.07 83.31,41.02 82.55,43.31 81.66,53.09 68.45,50.55 57.91,52.96 55.75,53.21 57.78,51.44 82.42,8.76 77.22,7.37 70.23,7.37 64.01,7.37 55.37,2.92 57.4,11.68 70.74,14.61 49.4,24.13 45.34,22.86 44.45,25.65 51.18,32.26 46.23,36.4 37.72,32.89 36.96,39.12 53.98,36.32 68.2,34.42 64.26,42.29 60.58,44.58 57.02,44.32 70.48,24.13 67.69,23.11 66.42,26.42 69.85,26.16 70.1,30.1 27.43,27.05 19.18,33.66 12.57,25.53 7.24,24.26 6.86,22.73 14.61,20.95 17.4,20.57 12.19,23.62 12.32,27.56 10.03,43.69 11.68,44.96 12.7,45.97 15.11,48.51 16.89,50.93 22.99,48.39 20.95,48.51 30.23,50.04 26.92,51.18 27.3,45.97 18.16,45.85 40.01,41.66 46.23,42.04 48.13,45.59 42.93,46.48 46.99,53.34 49.4,53.34 48.13,53.47 12.7,43.05 12.19,39.62 8.26,37.97 8.51,41.78 15.88,42.04 13.84,44.2 8,45.72 13.08,51.05 8,49.53 33.53,4.57 31.37,3.3 33.02,9.65 32.89,8.13 34.04,10.41 36.96,7.11 40.01,6.99 40.01,10.41 43.05,10.41 43.05,6.99 48.9,6.99 48.64,3.81 50.42,3.43 51.69,10.79 52.96,9.02 53.21,8 53.21,5.71 41.02,52.45 43.05,52.7 44.96,52.58 49.02,47.24 51.31,45.21 54.48,47.88 55.24,50.67 57.02,48.01 59.69,47.88 59.82,50.04 59.18,52.07 61.47,35.05 77.6,23.75 77.85,21.59 76.2,22.1 75.06,18.16 75.06,16 66.04,15.88 75.18,13.97 71.63,12.19 82.17,6.35 80.9,7.87 75.82,6.48 74.55,7.87 73.53,4.19 69.34,6.48 69.34,1.65 73.53,1.4 67.31,1.52 67.18,4.32 67.06,6.86 62.87,6.6 62.99,2.03 60.96,1.52 60.83,4.19 58.8,11.81 57.66,15.37 29.08,7.75 15.49,11.05 4.7,11.18 4.57,12.95 1.78,13.08 6.35,13.21 9.02,13.34 11.43,13.34 13.84,13.21 6.99,15.75 3.68,14.86 7.11,17.14 3.81,17.53 9.27,19.3 81.53,14.48 77.22,41.78 76.45,40.89 76.45,42.93 12.7,32.13 15.75,30.1 15.88,31.75 15.88,33.15 6.73,21.46 11.05,23.11 27.69,31.11 28.96,33.27 27.94,34.67 26.8,38.23 32,42.04 33.91,38.73 31.11,37.47 42.8,11.68 40.39,11.68 37.85,11.56 34.67,11.68 33.15,11.56 30.99,11.56 30.86,14.86 28.32,14.99 26.04,15.11 26.04,11.56 28.07,11.56 33.27,14.73 77.77,11.94 17.4,1.91 13.97,9.53 11.43,9.53 8.89,9.53 5.21,9.53 2.41,7.11 2.92,1.65 79.88,4.19
  pour Top: 0,53.98 84.96,53.98 84.96,0 0,0
  pour Bottom: 0,53.98 84.96,53.98 84.96,0 0,0
HS_I2C2_SCL  (via drill 0.3)
  Top 0.152: U3.4 v40.92,27.52
  Bottom 0.152: v40.92,27.52 33.2,19.79 J1.32
HS_I2C2_SDA  (via drill 0.3)
  Top 0.152: U3.5 v40.92,26.86
  Bottom 0.152: v40.92,26.86 34,19.94 J1.34
HS_I2C3_SCL  (via drill 0.3)
  Top 0.152: v40.92,26.21 U3.6
  Bottom 0.152: v40.92,26.21 34.8,20.09 J1.36
HS_I2C3_SDA  (via drill 0.3)
  Top 0.152: U3.7 v40.92,25.57
  Bottom 0.152: v40.92,25.57 35.6,20.24 J1.38
LS_GPIO0  (via drill 0.3)
  Top 0.152: U1.1 57.15,40.26 55.5,40.26 v55.35,40.12 | v19.05,44.7 15.11,44.7 v14.86,44.96
  Bottom 0.152: v55.35,40.12 55.34,40.13 50.46,40.13 45.89,44.7 v19.05,44.7 | v14.86,44.96 12,47.82 J2.3
LS_GPIO1  (via drill 0.3)
  Top 0.152: v56.08,38.99 U1.3
  Bottom 0.152: J2.5 14,46.42 16.46,43.97 45.84,43.97 50.41,39.4 55.68,39.4 v56.08,38.99
LS_GPIO2  (via drill 0.3)
  Top 0.152: v56.08,38.34 U1.4
  Bottom 0.152: J2.7 16,45.96 17.71,44.25 45.95,44.25 50.51,39.69 56,39.69 56.51,39.17 56.51,38.77 v56.08,38.34
LS_GPIO3  (via drill 0.3)
  Top 0.152: U1.5 v56.08,37.69
  Bottom 0.152: v56.08,37.69 56.79,38.4 56.79,39.29 55.44,40.64 50.35,40.64 46.01,44.98 20.87,44.98 J2.9
LS_GPIO4  (via drill 0.3)
  Top 0.152: U1.6 v56.08,37.04
  Bottom 0.152: v56.08,37.04 57.07,38.03 57.07,39.4 55.55,40.92 50.46,40.92 46.12,45.26 22.59,45.26 J2.11
LS_GPIO5  (via drill 0.3)
  Top 0.152: U1.7 55.68,36.39 v55.63,36.45 | v23.11,43.18 v23.11,45.85
  Bottom 0.152: v55.63,36.45 55.37,36.7 55.37,38.73 54.99,39.12 50.29,39.12 45.72,43.69 23.62,43.69 v23.11,43.18 | v23.11,45.85 22,46.96 J2.13
LS_GPIO6  (via drill 0.3)
  Top 0.152: U1.8 v56.08,35.74
  Bottom 0.152: v56.08,35.74 57.35,37.01 57.35,39.52 55.67,41.2 50.58,41.2 46.24,45.54 40.31,45.54 J2.29
LS_GPIO7  (via drill 0.3)
  Top 0.152: U1.9 v56.08,35.09
  Bottom 0.152: v56.08,35.09 57.63,36.64 57.63,39.63 55.78,41.48 50.69,41.48 46.35,45.82 42.03,45.82 J2.31
LS_GPIO8  (via drill 0.3)
  Top 0.152: v30.48,45.85 30.1,45.47 v30.1,43.23 | U3.1 40.92,29.46 v40.89,29.44
  Bottom 0.152: v30.48,45.85 31.16,46.53 31.16,48.81 31.54,49.19 40.47,49.19 41.8,47.85 J2.33 | v30.1,43.23 30.25,43.08 41.01,43.08 42.06,42.03 42.06,30.63 40.89,29.46 v40.89,29.44
LS_GPIO9  (via drill 0.3)
  Top 0.152: v24.77,51.82 v24.77,43.18 | U3.3 40.54,28.16 v40.51,28.19
  Bottom 0.152: v24.77,51.82 24.73,51.85 J2.16 | v24.77,43.18 26.92,43.18 27.3,42.8 40.89,42.8 41.78,41.91 41.78,31.11 40.26,29.59 40.26,28.45 v40.51,28.19
LS_GPIO10  (via drill 0.3)
  Top 0.152: U2.1 57.31,29.96 34.45,52.82 31.59,52.82 30.96,52.19 v27.02,52.19
  Bottom 0.152: v27.02,52.19 26.34,52.19 J2.18
LS_GPIO11  (via drill 0.3)
  Top 0.152: U2.3 v56.21,26.5
  Bottom 0.152: v56.21,26.5 57.91,28.19 57.91,39.75 48.38,49.27 40.77,49.27 40.58,49.47 29.64,49.47 28,51.1 J2.20
LS_GPIO12  (via drill 0.3)
  Top 0.152: v56.21,25.84 U2.4
  Bottom 0.152: v56.21,25.84 58.19,27.82 58.19,39.87 48.48,49.57 40.87,49.57 40.7,49.75 32.02,49.75 30,51.76 J2.22
LS_GPIO13  (via drill 0.3)
  Top 0.152: v56.21,25.2 U2.5
  Bottom 0.152: v56.21,25.2 58.47,27.45 58.47,39.98 48.49,49.96 40.88,49.96 40.81,50.02 39.83,50.02 J2.30
LS_GPIO14  (via drill 0.3)
  Top 0.152: v56.21,24.55 U2.6
  Bottom 0.152: v56.21,24.55 58.75,27.08 58.75,40.1 48.6,50.24 41.61,50.24 J2.32
LS_GPIO15  (via drill 0.3)
  Top 0.152: v56.21,23.89 U2.7
  Bottom 0.152: J2.34 42,51.1 42.58,50.52 48.72,50.52 59.03,40.21 59.03,26.71 v56.21,23.89
LS_I2C0_SCL  (via drill 0.3)
  Top 0.152: U5.1 v10.91,26.6
  Bottom 0.152: v10.91,26.6 10.91,48.56 11.54,49.19 23.42,49.19 24,48.6 J2.15
LS_I2C0_SDA  (via drill 0.3)
  Top 0.152: U5.3 v10.91,25.3
  Bottom 0.152: v10.91,25.3 10.48,25.73 10.48,46.36 10.63,46.51 10.63,48.68 11.42,49.47 25.14,49.47 26,48.6 J2.17
LS_I2C1_SCL  (via drill 0.3)
  Top 0.152: U5.4 v10.91,24.65
  Bottom 0.152: v10.91,24.65 9.42,26.15 9.42,49.07 10.09,49.75 26.86,49.75 28,48.6 J2.19
LS_I2C1_SDA  (via drill 0.3)
  Top 0.152: v10.91,24 U5.5
  Bottom 0.152: v10.91,24 9.14,25.78 9.14,49.18 11,51.05 11,52.65 11.54,53.19 18.46,53.19 18.76,52.89 18.76,51.29 19.82,50.23 28.37,50.23 30,48.6 J2.21
LS_MIO36_GPIO1_0  (via drill 0.3)
  Top 0.152: R21.1 22.64,36.24 23.54,37.14 23.54,41.94 24.05,42.44 31.24,42.44 32,43.2 v32,46.37
  Bottom 0.152: v32,46.37 J2.23
LS_MIO37_GPIO1_1  (via drill 0.3)
  Top 0.152: R24.1 31.96,36.15 31.26,35.44 31.26,32.4 31.38,32.28 32.6,32.28 32.95,32.62 32.95,49.42 v32,50.37
  Bottom 0.152: v32,50.37 J2.24
LS_MIO38_SPI0_SCLK  (via drill 0.3)
  Top 0.152: v16,50.37 9.52,43.89 U4.1
  Bottom 0.152: J2.8 v16,50.37
LS_MIO39_GPIO1_2  (via drill 0.3)
  Top 0.152: PSW3.1 PSW3.2 72.46,7.6 71.9,8.15 56.62,8.15 54.61,10.16 54.61,30.99 40.77,44.83 35.43,44.83 v34.04,46.23 33.87,46.39 R1.2
  Bottom 0.152: J2.25 34.04,47.82 v34.04,46.23
LS_MIO40_GPIO1_3  (via drill 0.3)
  Top 0.152: PSW4.1 PSW4.2 78.81,7.6 77.97,8.43 56.77,8.43 54.89,10.31 54.89,31.1 40.88,45.11 35.9,45.11 34.97,46.04 34.97,49.4 v34,50.37 34,51.94 R5.2
  Bottom 0.152: J2.26 v34,50.37
LS_MIO41_SPI0_CS  (via drill 0.3)
  Top 0.152: v20.76,51.81 20.05,51.81 16.74,48.5 16.66,48.5 10.69,42.53 10.69,40.68 10.76,40.62 10.76,38.73 10.1,38.07 U4.4
  Bottom 0.152: v20.76,51.81 20.04,51.81 J2.12
LS_MIO42_SPI0_MISO  (via drill 0.3)
  Top 0.152: v18,50.37 10.41,42.78 10.41,40.57 10.48,40.5 10.48,39.09 10.1,38.72 U4.3
  Bottom 0.152: J2.10 v18,50.37
LS_MIO43_SPI0_MOSI  (via drill 0.3)
  Top 0.152: v22.76,51.81 19,48.05 16.6,48.05 10.97,42.42 10.97,40.94 11.04,40.87 11.04,38.35 10.1,37.42 U4.5
  Bottom 0.152: v22.76,51.81 22.04,51.81 J2.14
LS_MIO44_GPIO1_4  (via drill 0.3)
  Top 0.152: U2.8 56.25,23.25 55.78,23.72 55.78,31.07 40.48,46.37 36.38,46.37 v36.06,46.05
  Bottom 0.152: J2.27 36,46.11 v36.06,46.05
LS_MIO45_GPIO1_5  (via drill 0.3)
  Top 0.152: v36,50.37 35.57,49.94 35.57,45.84 35.94,45.47 40.92,45.47 55.5,30.89 55.5,23.6 56.51,22.59 U2.9
  Bottom 0.152: J2.28 v36,50.37
MIO6_SPI1_SCLK  (via drill 0.3)
  Top 0.152: v8.42,36.77 U4.6
  Bottom 0.152: v8.42,36.77 8.85,36.34 8.85,24.37 18.41,14.81 24.02,14.81 24.4,14.43 J1.9
MIO9_SPI1_CS  (via drill 0.3)
  Top 0.152: v8.42,35.47 U4.8
  Bottom 0.152: v8.42,35.47 7.99,35.04 7.99,24.44 20.34,12.1 23.15,12.1 23.6,12.55 J1.7
MIO10_SPI1_MISO  (via drill 0.3)
  Top 0.152: v8.42,36.12 U4.7
  Bottom 0.152: v8.42,36.12 7.71,35.41 7.71,24.32 20.22,11.82 24.47,11.82 25.2,12.55 J1.11
MIO11_SPI1_MOSI  (via drill 0.3)
  Top 0.152: v8.42,34.82 U4.9
  Bottom 0.152: v8.42,34.82 8.42,24.41 19.53,13.3 J1.1
N$1
  Top 0.152: LED1.A R2.1
N$2  (via drill 0.3)
  Top 0.152: Q1.6 v64.23,15.08 | v62.47,12.7 62.47,10.79 LED1.K
  Bottom 0.152: v64.23,15.08 62.47,13.32 v62.47,12.7
N$3
  Top 0.152: 61.17,14.61 R3.2 | 61.17,14.61 R4.2 | Q1.2 61.2,14.58 61.17,14.61
N$4
  Top 0.152: R9.1 LED3.A
N$5
  Top 0.152: R6.1 LED2.A
N$6  (via drill 0.3)
  Top 0.152: v76.44,11.56 75.94,11.56 LED3.K | v76.95,15.11 Q2.6
  Bottom 0.152: v76.44,11.56 76.95,12.08 v76.95,15.11
N$7
  Top 0.152: R16.1 54.08,50.84 POW.A
N$8
  Top 0.152: LED2.K 65.39,12.95 64.14,12.95 63.27,13.82 Q1.3
N$9
  Top 0.152: LED4.K 76.94,14.11 Q2.3
N$16  (via drill 0.3)
  other vias: 21.84,40.39
N$17  (via drill 0.3)
  other vias: 19.05,37.59
N$21
  Top 0.152: 68.88,14.58 68.91,14.61 68.91,15.86 R7.2 | R8.2 68.91,14.55 68.88,14.58 | 68.88,14.58 Q1.5
N$23
  Top 0.152: 72.05,14.61 R10.2 | 72.05,14.61 R11.2 | 72.05,14.61 Q2.2
N$24
  Top 0.152: LED5.A 22.62,30.59 R19.1
N$25
  Top 0.152: LED4.A R12.1
N$27
  Top 0.152: Q3.6 27.95,36.7 27.3,36.05 27.3,35.35 24.97,33.02 LED5.K
N$28
  Top 0.152: R20.2 R21.2 Q3.2
N$29
  Top 0.152: LED6.A 30.24,30.5 R22.1
N$30
  Top 0.152: Q3.3 26.66,35.7 27,36.04 27,36.81 29.68,39.49 32.55,39.49 32.67,39.37 32.67,33.71 31.99,33.03 LED6.K
N$31
  Top 0.152: Q3.5 R24.2 R23.2
N$33
  Top 0.152: 79.8,14.61 R14.2 | 79.8,14.61 R13.2 | Q2.5 79.8,14.61
N$35  (via drill 0.3)
  other vias: 33.02,50.42
N$36  (via drill 0.3)
  other vias: 34.92,50.42
N$37  (via drill 0.3)
  other vias: 36.96,46.99
N$68  (via drill 0.3)
  other vias: 71.12,40.39
PH1_1
  Top 0.152: JP4.3 3.78,32.63 9.33,32.63 12.64,35.94 12.64,37.56 15.07,40 15.64,40 U4.20
PH1_2
  Top 0.152: U4.18 14.32,38.72 12.92,37.32 12.92,35.83 8.45,31.36 JP4.4
PH1_3
  Top 0.152: U4.17 14.06,38.07 13.2,37.2 13.2,35.71 7.58,30.09 3.78,30.09 JP4.5
PH1_4
  Top 0.152: U4.16 13.82,37.42 13.79,37.39 13.47,37.07 13.47,35.59 6.7,28.82 JP4.6
PH1_5
  Top 0.152: JP4.7 3.78,27.55 5.83,27.55 15.04,36.77 U4.15
PH1_6
  Top 0.152: U4.14 15.08,36.13 14.14,35.2 14.14,33.26 14.56,32.84 14.56,31.42 13.59,30.45 9.22,30.45 JP4.8
PH1_7
  Top 0.152: U4.13 15.08,35.48 14.42,34.82 14.42,33.37 14.84,32.96 14.84,31.3 13.6,30.06 10.41,30.06 5.51,25.16 3.93,25.16 JP4.9
PH1_8
  Top 0.152: U4.12 15.08,34.83 14.7,34.45 14.7,33.92 15.12,33.51 15.12,31.19 13.6,29.67 10.98,29.67 JP4.10
PH1_9
  Top 0.152: R15.1 16.71,26.4 16.51,26.6 U5.20 15.94,28.54 15.2,29.28 11.27,29.28 6.79,24.8 6.79,23.45 5.78,22.45 3.76,22.45 JP4.11
PH1_10
  Top 0.152: R15.2 17.51,25.9 16.91,25.3 U5.18 15.37,25.3 11.71,21.64 11.71,21.09 10.99,20.38 5.87,20.38 JP4.12
PH1_11
  Top 0.152: R15.3 17.88,25.4 17.13,24.65 U5.17 15.37,24.65 11.99,21.27 11.99,20.98 10.95,19.94 3.79,19.94 JP4.13
PH1_12
  Top 0.152: R15.4 18.25,24.9 17.36,24 U5.16 15.37,24 12.27,20.9 12.27,20.86 10.07,18.66 JP4.14
PINHD1_VDD  (via drill 0.3)
  Top 0.152: C18.2 13.68,27.64 15.36,25.95 U5.19 | U4.19 18.92,39.37 18.99,39.43
  Top 0.305: R15.5 R15.6 R15.7 R15.8 17.54,28.57 v16.76,28.57 16.76,37.21 18.99,39.43 19.3,39.75 JP3.2 19.3,42.8 18.92,43.18 15.02,43.18 C16.2 | C18.2 v14.86,28.57
  Bottom 0.305: v14.86,28.57 v16.76,28.57
PMOD1_1
  Top 0.152: PMOD1.1 67.18,47.05 67.18,43.34 64.13,40.29 U1.20
PMOD1_2
  Top 0.127: 63.76,38.99 U1.18
  Top 0.152: PMOD1.3 67.5,44.84 67.5,42.62 63.88,38.99 63.76,38.99
PMOD1_3
  Top 0.152: PMOD1.5 70.3,47.04 67.78,44.52 67.78,42.25 63.9,38.36 63.33,38.36 U1.17
PMOD1_4
  Top 0.152: PMOD1.7 69.02,44.5 68.06,43.55 68.06,41.88 63.9,37.71 63.33,37.71 U1.16
PMOD1_5
  Top 0.127: 63.81,37.04 U1.15
  Top 0.152: PMOD1.2 73.36,50.7 73.36,44.04 72.46,43.14 69.97,43.14 63.88,37.04 63.81,37.04
PMOD1_6
  Top 0.127: 75.89,48.48 75.89,38.96 73.34,36.41
  Top 0.152: PMOD1.4 75.89,48.48 | 73.34,36.41 U1.14
PMOD1_7  (via drill 0.3)
  Top 0.127: v64.42,35.76 U1.13
  Bottom 0.127: 71.89,43.23 v64.42,35.76
  Bottom 0.152: PMOD1.6 73.52,45.77 73.52,44.21 73.52,44.19 72.56,43.23 72.54,43.23 71.89,43.23
PMOD1_8  (via drill 0.3)
  Top 0.152: v64.42,35.11 U1.12
  Bottom 0.127: 73.52,39.13 69.5,35.11 v64.42,35.11
  Bottom 0.152: PMOD1.8 73.52,43.23 73.52,39.13
PMOD1_VDD  (via drill 0.3)
  Top 0.2: C13.2 70.22,39.42 PMOD1.11
  Top 0.305: PMOD1.12 PMOD1.11 | C8.2 61.05,41.12 62.52,39.64 U1.19 62.65,39.64 62.23,39.23 62.23,34.22 62.92,33.53 64.39,33.53 65.41,32.51 | 65.41,32.51 JP1.2 | v68.71,33.66 66.55,33.66 65.41,32.51
  Bottom 0.305: PMOD1.12 69.02,33.66 v68.71,33.66
PMOD2_1
  Top 0.127: PMOD2.1 70.03,33.81 64.02,27.8 U2.20
PMOD2_2
  Top 0.127: PMOD2.3 68.76,31.27 63.99,26.5 U2.18
PMOD2_3
  Top 0.127: PMOD2.5 67.2,28.73 64.31,25.84 U2.17
PMOD2_4
  Top 0.127: PMOD2.7 71.28,25.2 U2.16
PMOD2_5
  Top 0.127: PMOD2.2 73.55,32.54 73.55,25.9 72.53,24.88 64.7,24.88 64.37,24.55 U2.15
PMOD2_6
  Top 0.127: PMOD2.4 75.92,30.16 75.92,23.19 75.28,22.55 71.42,22.55 70.06,23.91 U2.14
PMOD2_7  (via drill 0.3)
  Top 0.127: v64.55,23.26 U2.13
  Bottom 0.127: PMOD2.6 73.55,27.46 68.75,27.46 v64.55,23.26
PMOD2_8  (via drill 0.3)
  Top 0.127: v64.55,22.61 U2.12
  Bottom 0.127: PMOD2.8 73.55,24.92 66.86,24.92 v64.55,22.61
PMOD2_VDD
  Top 0.305: U2.19 62.32,27.14 61.17,28.29 C6.2 61.17,22.91 62.58,21.51 64.5,21.51 65.32,20.69 65.32,20.16 JP2.2 65.41,19.43 65.91,18.92 68.03,18.92 C14.2 71.91,20.74 PMOD2.11 PMOD2.12
PWR_BTN  (via drill 0.3)
  Top 0.152: PWR.1 PWR.2 11.77,50.6 v12,50.37
  Bottom 0.152: J2.4 v12,50.37
RST_BTN  (via drill 0.3)
  Top 0.152: v14,50.37 7.88,44.26 RST.2 RST.1
  Bottom 0.152: J2.6 v14,50.37

### Text on the board
tPlace: 5V 3V3 | Ultra96-V2 | MIPI CSI-2 / Board | Rev 1.0 | 5V 3V3 | CSI0 | 5V 3V3 | @fumi_maker
bPlace: JLCJLCJLC